# EAGLE design AutonoeGingerBread3 (EAGLE 9.6.2)
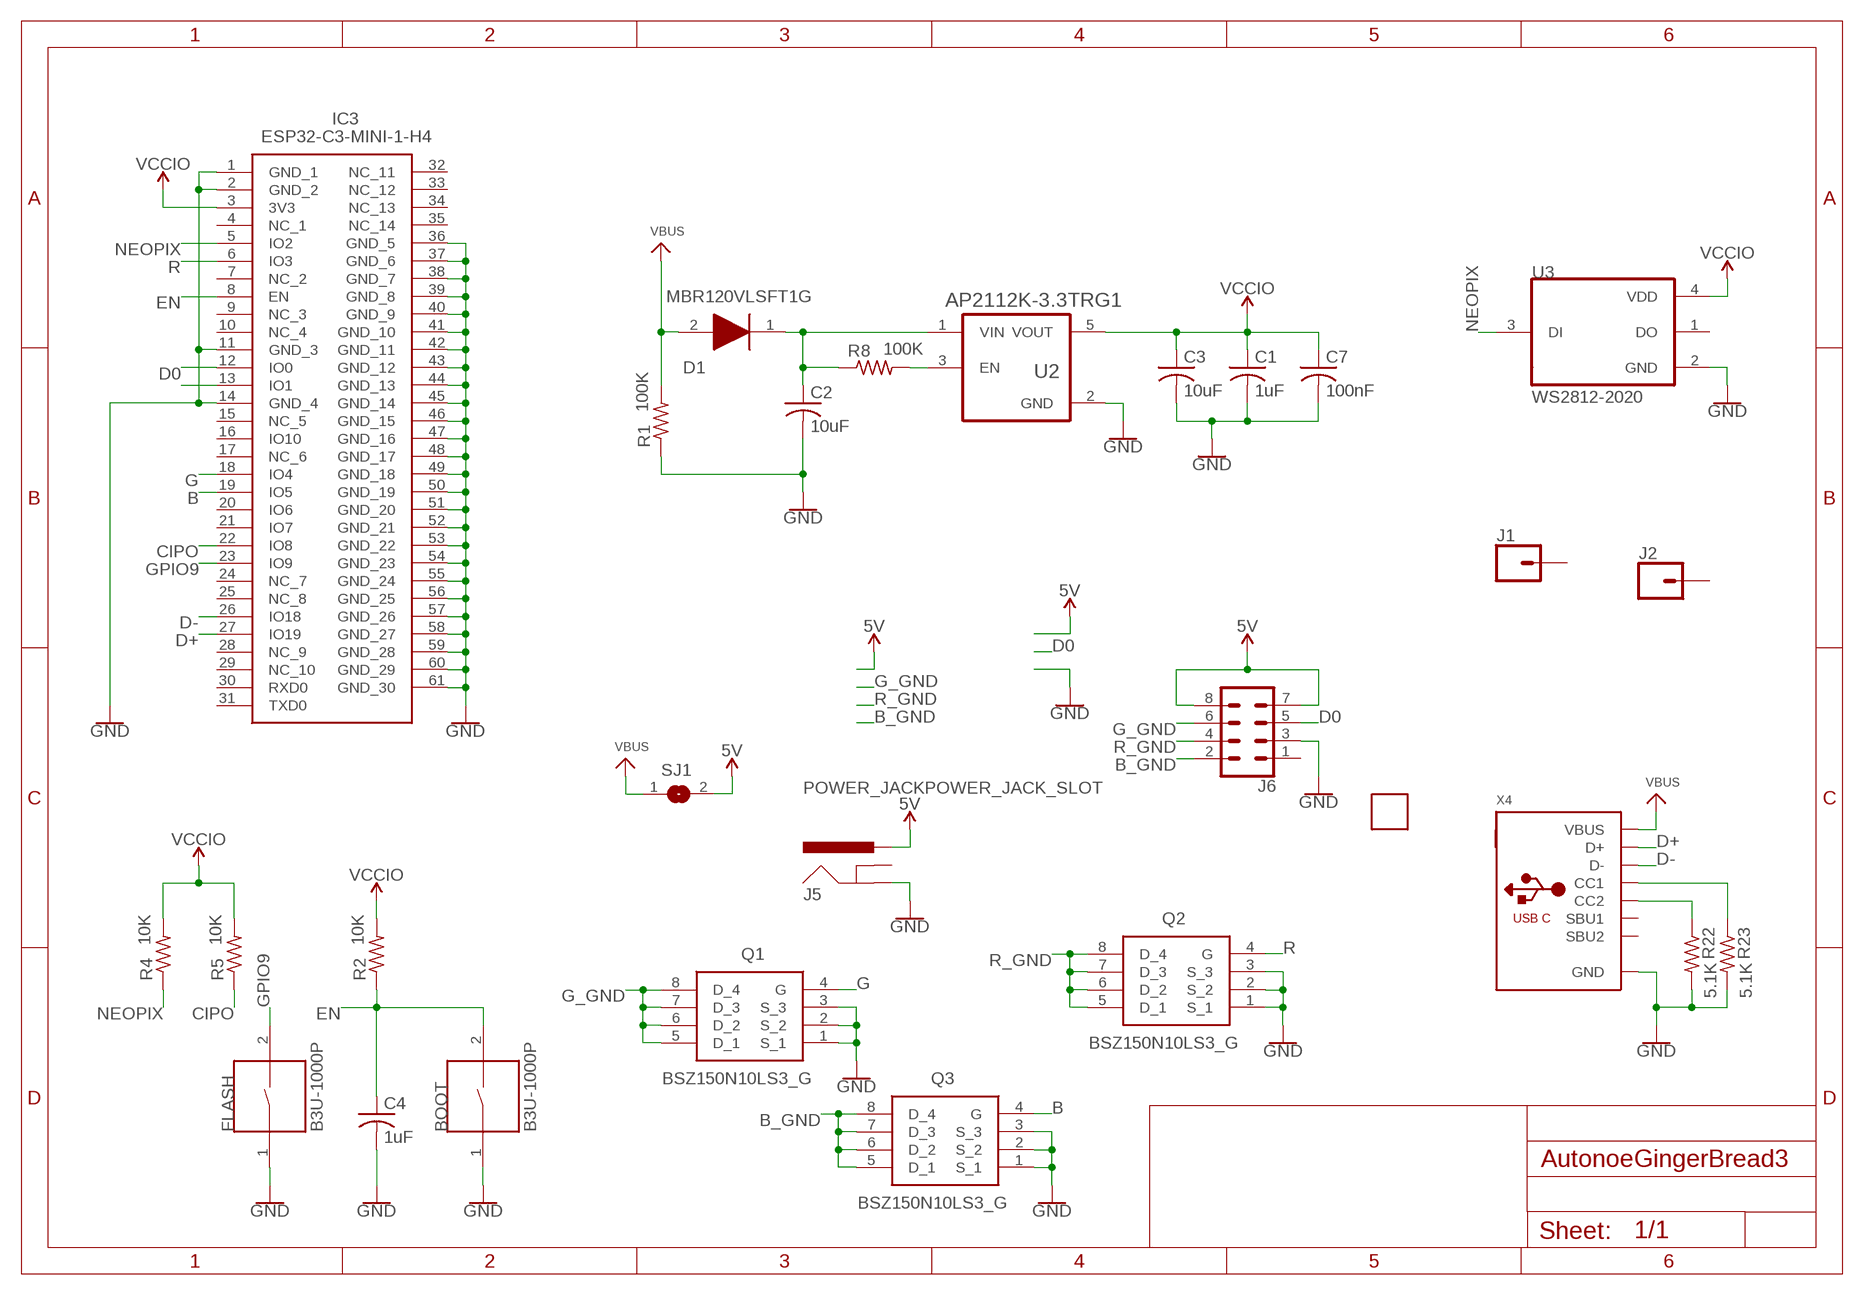
[diagram p0: schematic, sheet 1]

## Parts
BOOT  B3U-1000P  [SW_B3U-1000P]
C1  1uF  C-USC0402  [C0402]
C2  10uF  C-USC0402  [C0402]
C3  10uF  C-USC0402  [C0402]
C4  1uF  C-USC0402  [C0402]
C7  100nF  C-USC0402  [C0402]
D1  MBR120VLSFT1G  [SODFL3616X98N]
FLASH  B3U-1000P  [SW_B3U-1000P]
IC3  ESP32-C3-MINI-1-H4  [ESP32C3MINI1H4]
J1  CONN_01PTH_2MM  [1X01_2MM]
J2  CONN_01PTH_2MM  [1X01_2MM]
J5  POWER_JACKPOWER_JACK_SLOT  [POWER_JACK_PTH_SLOT]
J6  CONN_04X2  [2X4]
Q1  BSZ150N10LS3_G  [BSZ180P03NS3EGATMA1]
Q2  BSZ150N10LS3_G  [BSZ180P03NS3EGATMA1]
Q3  BSZ150N10LS3_G  [BSZ180P03NS3EGATMA1]
R1  100K  R-US_R0402  [R0402]
R2  10K  R-US_R0402  [R0402]
R4  10K  R-US_R0402  [R0402]
R5  10K  R-US_R0402  [R0402]
R8  100K  R-US_R0402  [R0402]
R22  5.1K  R-US_R0402  [R0402]
R23  5.1K  R-US_R0402  [R0402]
SJ1  SJ  [SJ]
U2  AP2112K-3.3TRG1  [SOT95P285X140-5N]
U3  WS2812-2020  [LED_WS2812-2020]
U$3  SMARTT_SMALL  [SMARTT_SMALL]
X4  MICROBUILDER_USB_C  [MICROBUILDER_USB_C_CUSB31-CFM2AX-01-X]

## Nets
5V: J5.PWR J6.7 J6.8 SJ1.2
B: IC3.19(IO5) Q3.4(G)
B_GND: J6.2 Q3.5(D_1) Q3.6(D_2) Q3.7(D_3) Q3.8(D_4)
CIPO: IC3.22(IO8) R5.1
D0: IC3.12(IO0) J6.5
D+: IC3.27(IO19) X4.A6(D+) X4.B6(D+)
D-: IC3.26(IO18) X4.A7(D-) X4.B7(D-)
EN: BOOT.2 C4.1 IC3.8(EN) R2.1
G: IC3.18(IO4) Q1.4(G)
G_GND: J6.6 Q1.5(D_1) Q1.6(D_2) Q1.7(D_3) Q1.8(D_4)
GND: BOOT.1 C1.2 C2.2 C3.2 C4.2 C7.2 FLASH.1 IC3.1(GND_1) IC3.2(GND_2) IC3.11(GND_3) IC3.14(GND_4) IC3.36(GND_5) IC3.37(GND_6) IC3.38(GND_7) IC3.39(GND_8) IC3.40(GND_9) IC3.41(GND_10) IC3.42(GND_11) IC3.43(GND_12) IC3.44(GND_13) IC3.45(GND_14) IC3.46(GND_15) IC3.47(GND_16) IC3.48(GND_17) IC3.49(GND_18) IC3.50(GND_19) IC3.51(GND_20) IC3.52(GND_21) IC3.53(GND_22) IC3.54(GND_23) IC3.55(GND_24) IC3.56(GND_25) IC3.57(GND_26) IC3.58(GND_27) IC3.59(GND_28) IC3.60(GND_29) IC3.61(GND_30) J5.GND J6.3 Q1.1(S_1) Q1.2(S_2) Q1.3(S_3) Q2.1(S_1) Q2.2(S_2) Q2.3(S_3) Q3.1(S_1) Q3.2(S_2) Q3.3(S_3) R1.1 R22.2 R23.2 U2.2(GND) U3.2(GND) X4.A1B12(GND) X4.B1A12(GND)
GPIO9: FLASH.2 IC3.23(IO9)
N$1: IC3.13(IO1)
N$2: C2.1 D1.1(K) R8.1 U2.1(VIN)
N$7: R22.1 X4.B5(CC2)
N$9: R23.1 X4.A5(CC1)
N$23: R8.2 U2.3(EN)
NEOPIX: IC3.5(IO2) R4.1 U3.3(DI)
R: IC3.6(IO3) Q2.4(G)
R_GND: J6.4 Q2.5(D_1) Q2.6(D_2) Q2.7(D_3) Q2.8(D_4)
VBUS: D1.2(A) R1.2 SJ1.1 X4.A4B9(VBUS) X4.B4A9(VBUS)
VCCIO: C1.1 C3.1 C7.1 IC3.3(3V3) R2.2 R4.2 R5.2 U2.5(VOUT) U3.4(VDD)
Unconnected: IC3.4(NC_1) IC3.7(NC_2) IC3.9(NC_3) IC3.10(NC_4) IC3.15(NC_5) IC3.16(IO10) IC3.17(NC_6) IC3.20(IO6) IC3.21(IO7) IC3.24(NC_7) IC3.25(NC_8) IC3.28(NC_9) IC3.29(NC_10) IC3.30(RXD0) IC3.31(TXD0) IC3.32(NC_11) IC3.33(NC_12) IC3.34(NC_13) IC3.35(NC_14) J1.1 J2.1 J5.GNDBREAK J6.1 U3.1(DO) X4.A8(SBU1) X4.B8(SBU2)

## Library data of the parts
BOOT FLASH = B3U-1000P:B3U-1000P: Switch Tactile N.O. SPST Round Button Gull Wing 0.05A 12VDC 1.5N SMD Embossed T/R; AVAILABILITY: Unavailable; DESCRIPTION: Switch Tactile N.O. SPST Round Button Gull Wing 0.05A 12VDC 1.5N SMD Embossed T/R; MF: Omron; MP: B3U-1000P; PACKAGE: None; PRICE: None
C1-C4 C7 = adafruit:C-US: CAPACITOR, American symbol
D1 = MBR120VLSFT1G:MBR120VLSFT1G: Diode Schottky 20V 1A SOD123FL ON Semi MBR120VLSFT1G, SMT Schottky Diode, 20V 1A, 2-Pin SOD-123FL Source: Datasheet <http://www.onsemi.com/pub/Collateral/MBR120VLSFT1-D.PDF>; DESCRIPTION: Diode Schottky 20V 1A SOD123FL ON Semi MBR120VLSFT1G, SMT Schottky Diode, 20V 1A, 2-Pin SOD-123FL; HEIGHT: 0.98mm; MANUFACTURER_NAME: ON Semiconductor; MANUFACTURER_PART_NUMBER: MBR120VLSFT1G; MOUSER_PART_NUMBER: 863-MBR120VLSFT1G; MOUSER_PRICE-STOCK: https://www.mouser.co.uk/ProductDetail/ON-Semiconductor/MBR120VLSFT1G?qs=3JMERSakebpX%252BkItPpFCkg%3D%3D
IC3 = ESP32-C3-MINI-1-H4:ESP32-C3-MINI-1-H4: SMD MODULE, ESP32-C3FH4, PCB ANT Source: Datasheet <https://www.mouser.es/datasheet/2/891/Espressif_ESP32_C3_MINI_1_Datasheet-2006822.pdf>; DESCRIPTION: SMD MODULE, ESP32-C3FH4, PCB ANT; HEIGHT: 2.55mm; MANUFACTURER_NAME: Espressif Systems; MANUFACTURER_PART_NUMBER: ESP32-C3-MINI-1-H4; MOUSER_PART_NUMBER: 356-ESP32-C3-MINI1H4; MOUSER_PRICE-STOCK: https://www.mouser.co.uk/ProductDetail/Espressif-Systems/ESP32-C3-MINI-1-H4?qs=stqOd1AaK78JkwNX13Q9hQ%3D%3D
J1 J2 = SparkFun-Connectors:CONN_01: Single connection point. Often used as Generic Header-pin footprint for 0.1 inch spaced/style header connections On any of the 0.1 inch spaced packages, you can populate with these: Break Away Headers - Straight <https://www.sparkfun.com/products/116> (PRT-00116) Break Away Male Headers - Right Angle <https://www.sparkfun.com/products/553> (PRT-00553) Female Headers <https://www.sparkfun.com/products/115> (PRT-00115) Break Away Headers - Machine Pin <https://www.sparkfun.com/products/117> (PRT-00117) Break Away Female Headers - Swiss Machine Pin <https://www.sparkfun.com/products/743> (PRT-00743) This device is also useful as a general connection point to wire up your design to another part of your project. Our various solder wires solder well into these plated through hole pads. Hook-Up Wire - Assortment (Stranded, 22 AWG) <https://www.sparkfun.com/products/11375> (PRT-11375) Hook-Up Wire - Assortment (Solid Core, 22 AWG) <https://www.sparkfun.com/products/11367> (PRT-11367) View the entire wire category on our website here <https://www.sparkfun.com/categories/141> Special notes: SMTSO-256-ET is a "flush mount" nut for a 4-40 screw. We mostly use this on specialty testbeds; it is a nice way to connect hardware to your PCB at an adjustable hieght. Also note, the SNAP packages are for using a snappable style connector. We sell a baggie of snaps and they are also used on two LilyPad designs: Snap Assortment - 30 pack (male and female) <https://www.sparkfun.com/products/11347> (DEV-11347) LilyPad Arduino SimpleSnap <https://www.sparkfun.com/products/10941> (DEV-10941) LilyPad SimpleSnap Protoboard <https://www.sparkfun.com/products/10940> (DEV-10940)
J5 = SparkFun-Connectors:POWER_JACK: Power Jack Connector This is the standard 5.5mm barrel jack for power. The PTH is the most common, proven, reliable, footprint. The Slot footprint only works if the mill layer is transmitted to the PCB fab house so be warned. Here are the connectors we sell at SparkFun: DC Barrel Power Jack/Connector <https://www.sparkfun.com/products/119> (PRT-00119) DC Barrel Power Jack/Connector (SMD) <https://www.sparkfun.com/products/12748> (PRT-12748) DC Barrel Jack Adapter - Breadboard Compatible <https://www.sparkfun.com/products/10811> (PRT-10811) It is used on this SparkFun product (and many, many others): SparkFun RedBoard - Programmed with Arduino <https://www.sparkfun.com/products/12757> (DEV-12757) Also, if you need a mating power supply or connector, please check these out: Wall Adapter Power Supply - 9VDC 650mA <https://www.sparkfun.com/products/298> (TOL-00298) DC Barrel Jack Adapter - Male <https://www.sparkfun.com/products/10287> (PRT-10287); PROD_ID: CONN-08197
J6 = SparkFun-Connectors:CONN_04X2: Multi connection point. Often used as Generic Header-pin footprint for 0.1 inch spaced/style header connections On any of the 0.1 inch spaced packages, you can populate with these: Break Away Headers - Straight <https://www.sparkfun.com/products/116> (PRT-00116) Break Away Male Headers - Right Angle <https://www.sparkfun.com/products/553> (PRT-00553) Female Headers <https://www.sparkfun.com/products/115> (PRT-00115) Break Away Headers - Machine Pin <https://www.sparkfun.com/products/117> (PRT-00117) Break Away Female Headers - Swiss Machine Pin <https://www.sparkfun.com/products/743> (PRT-00743)
Q1-Q3 = BSZ150N10LS3_G:BSZ150N10LS3_G: MOSFET N-Ch 100V 40A TSDSON-8 Source: Datasheet <https://www.infineon.com/dgdl/Infineon-BSZ150N10LS3_G-DS-v02_02-en.pdf?fileId=db3a30433c8a9179013c8aa12472000f>; DESCRIPTION: MOSFET N-Ch 100V 40A TSDSON-8; HEIGHT: mm; MANUFACTURER_NAME: Infineon; MANUFACTURER_PART_NUMBER: BSZ150N10LS3 G; MOUSER_PART_NUMBER: 726-BSZ150N10LS3G; MOUSER_PRICE-STOCK: https://www.mouser.co.uk/ProductDetail/Infineon-Technologies/BSZ150N10LS3-G?qs=LxJ0xX%2FWJR7cCiHBsoYJ%252Bw%3D%3D
R1 R2 R4 R5 R8 R22 R23 = adafruit:R-US_: RESISTOR, American symbol
SJ1 = jumper:SJ: SMD solder JUMPER
U2 = AP2112K-3.3TRG1:AP2112K-3.3TRG1: AP2112 Series 0.6 A 3.3 V Fixed Output SMT LDO Linear Regulator - SOT23-5; AVAILABILITY: Unavailable; DESCRIPTION: AP2112 Series 0.6 A 3.3 V Fixed Output SMT LDO Linear Regulator - SOT23-5; MF: Diodes Inc.; MP: AP2112K-3.3TRG1; PACKAGE: SOT-753 Diodes Inc.; PRICE: None
U3 = WS2812-2020:WS2812-2020: Intelligent control LED integrated light source Check availability <https://pricing.snapeda.com/parts/WS2812-2020/Worldsemi/view-part?ref=eda>; AVAILABILITY: Not in stock; DESCRIPTION: Intelligent control LED light source, SMD-4; MF: Worldsemi; MP: WS2812-2020; PACKAGE: Package; PRICE: None
U$3 = Bitmaps:SMARTT_SMALL
X4 = Adafruit Feather STM32F405 Express:MICROBUILDER_USB_C: USB Type-C USB 2.0 Connector

## Board
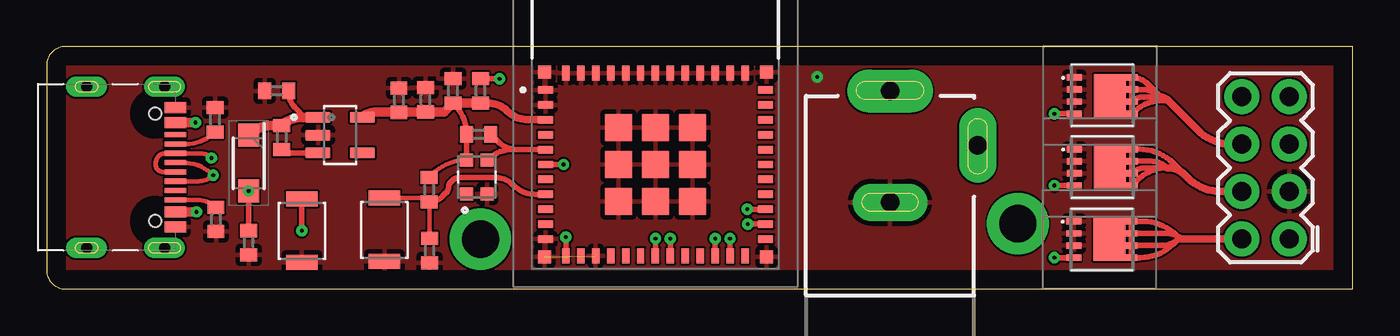
[diagram p1: board, top side]
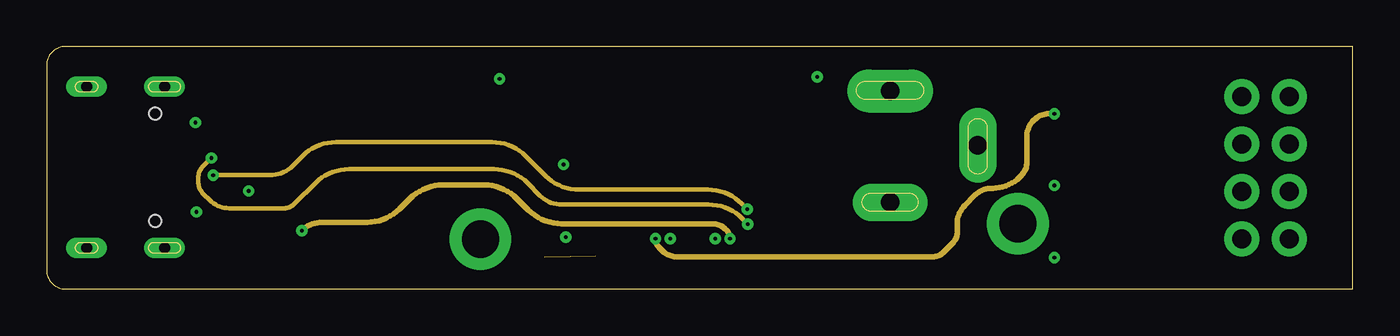
[diagram p2: board, inner layer Route2]
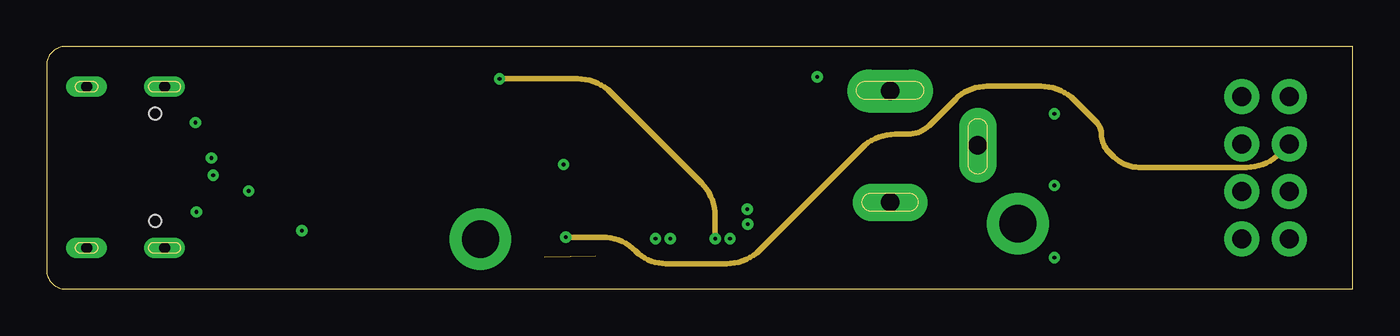
[diagram p3: board, inner layer Route15]
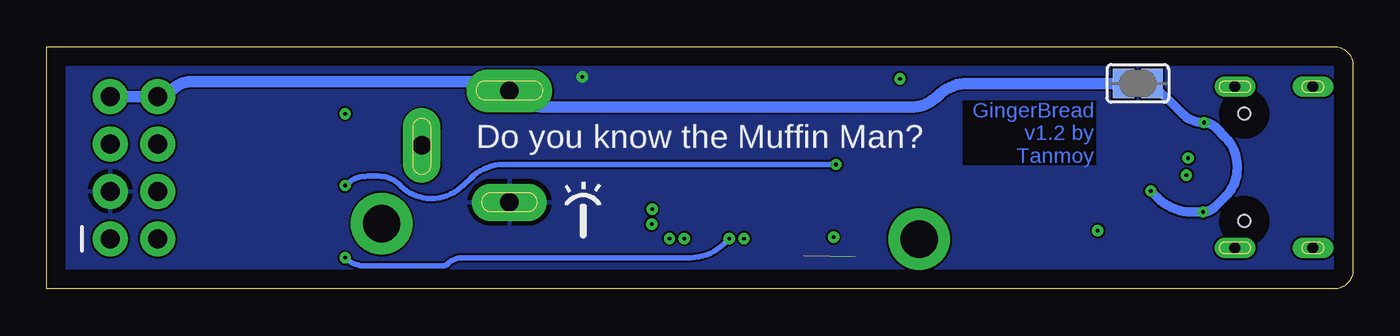
[diagram p4: board, bottom side, seen from below]

Size 70 x 13 mm. Coordinates in mm from the lower left corner, seen from the top.
Outline: 0,12 0,1 arc90 1,0 70,0 70,13 1,13 0.91,13 arc85 0,12
Copper layers (1+2*15+16): Top 0.035mm / dielectric 0.2mm / Route2 0.035mm / dielectric 0.15mm / Route15 0.035mm / dielectric 0.2mm / Bottom 0.035mm
Design rules "default *": minimum track width 4mil, minimum drill 0.2mm, track to track 4mil, track to pad 6mil, pad to pad 4mil, via to via 4mil, smd to smd 4mil, copper to edge 40mil, drill to drill 4mil, minimum pad ring 10mil, minimum via ring 8mil, stop-mask expansion 4mil, vias tented up to drill 0mil, thermal gap 10mil

### Footprints (pad centres in the part's own frame; a part is rotated, then mirrored left to right if it is on the bottom)
SW_B3U-1000P = smd 0.8 x 1.7: 1 -1.7,0; 2 1.7,0
C0402 = smd 0.7 x 0.9: 1 -0.65,0; 2 0.65,0
SODFL3616X98N = smd 1.24 x 1.12: 1 -1.5,0; 2 1.5,0
ESP32C3MINI1H4 = smd 0.8 x 0.4: 1 -5.9,4; 2 -5.9,3.2; 3 -5.9,2.4; 4 -5.9,1.6; 5 -5.9,0.8; 6 -5.9,0; 7 -5.9,-0.8; 8 -5.9,-1.6; 9 -5.9,-2.4; 10 -5.9,-3.2; 11 -5.9,-4; 25 5.9,-4; 26 5.9,-3.2; 27 5.9,-2.4; 28 5.9,-1.6; 29 5.9,-0.8; 30 5.9,0; 31 5.9,0.8; 32 5.9,1.6; 33 5.9,2.4; 34 5.9,3.2; 35 5.9,4 | smd 0.4 x 0.8: 12 -4.8,-4.9; 13 -4,-4.9; 14 -3.2,-4.9; 15 -2.4,-4.9; 16 -1.6,-4.9; 17 -0.8,-4.9; 18 0,-4.9; 19 0.8,-4.9; 20 1.6,-4.9; 21 2.4,-4.9; 22 3.2,-4.9; 23 4,-4.9; 24 4.8,-4.9; 36 4.8,4.9; 37 4,4.9; 38 3.2,4.9; 39 2.4,4.9; 40 1.6,4.9; 41 0.8,4.9; 42 0,4.9; 43 -0.8,4.9; 44 -1.6,4.9; 45 -2.4,4.9; 46 -3.2,4.9; 47 -4,4.9; 48 -4.8,4.9 | smd 1.45 x 1.45: 49 0,0; 50 1.975,1.975; 51 0,1.975; 52 -1.975,1.975; 53 -1.975,0; 54 -1.975,-1.975; 55 0,-1.975; 56 1.975,-1.975; 57 1.975,0 | smd 0.7 x 0.7: 58 -5.95,4.95; 59 -5.95,-4.95; 60 5.95,-4.95; 61 5.95,4.95
1X01_2MM = drill 2 pad 3.302: 1 0,0
POWER_JACK_PTH_SLOT = drill 1 pad 2 long: GND 0,0; GNDBREAK -3.048,4.699 | drill 1 pad 2.3 long: PWR -5.969,0
2X4 = drill 1.016 pad 1.88: 1 -3.81,-1.27; 2 -3.81,1.27; 3 -1.27,-1.27; 4 -1.27,1.27; 5 1.27,-1.27; 6 1.27,1.27; 7 3.81,-1.27; 8 3.81,1.27
BSZ180P03NS3EGATMA1 = smd 0.8 x 0.34: 1 1.5,-0.975; 2 1.5,-0.325; 3 1.5,0.325; 4 1.5,0.975 | smd 0.65 x 0.34: 5 -1.575,0.975; 6 -1.575,0.325; 7 -1.575,-0.325; 8 -1.575,-0.975 | smd 1.71 x 2.29: 9 -0.395,0
R0402 = smd 0.7 x 0.9: 1 -0.65,0; 2 0.65,0
SJ = smd 1.168 x 1.6: 1 -0.762,0; 2 0.762,0
SOT95P285X140-5N = smd 1.35 x 0.6: 1 -1.185,0.95; 2 -1.185,0; 3 -1.185,-0.95; 4 1.185,-0.95; 5 1.185,0.95
LED_WS2812-2020 = smd 0.7 x 0.7: 1 -0.915,0.55; 2 -0.915,-0.55; 3 0.915,-0.55; 4 0.915,0.55
MICROBUILDER_USB_C_CUSB31-CFM2AX-01-X = smd 0.575 x 1.15: A1B12 -3.2,3.545; A4B9 -2.4,3.545; B1A12 3.2,3.545; B4A9 2.4,3.545 | smd 0.275 x 1.15: A5 -1.25,3.545; A6 -0.25,3.545; A7 0.25,3.545; A8 1.25,3.545; B5 1.75,3.545; B6 0.75,3.545; B7 -0.75,3.545; B8 -1.75,3.545 | drill 0.6 pad 1 long: M1 -4.32,2.97; M2 4.32,2.97; M3 -4.32,-1.21; M4 4.32,-1.21 | hole 0.65: 2.89,2.47; -2.89,2.47

### Placement (x,y rotation side)
BOOT  18.1,3.17 90 top
C1  21.77,10.62 90 top
C2  12.32,10.62 180 top
C3  20.3,10.15 90 top
C4  20.52,2.05 270 top
C7  18.88,10.12 90 top
D1  10.82,6.75 270 top
FLASH  13.68,3.12 90 top
IC3  32.62,6.67 0 top
J1  23.25,2.67 0 top
J2  52.05,3.5 0 top
J5  45.2,4.65 270 top
J6  65.33,6.5 90 top
Q1  56.58,10.38 180 top
Q2  56.58,6.53 180 top
Q3  56.55,2.65 180 top
R1  10.82,2.48 90 top
R2  20.5,5.33 90 top
R4  23.15,8.3 180 top
R5  23.25,10.62 270 top
R8  12.6,8.12 270 top
R22  9.07,3.73 270 top
R23  9.03,9.07 90 top
SJ1  11.53,11.03 180 bottom
U2  15.72,8.25 0 top
U3  23.05,6 90 top
U$3  39.98,2.6 0 top
X4  3.35,6.53 270 top

### Tracks (layer width: path | path; a pad name or v marks a point on that pad's centre or on a via)
5V
  Bottom 0.508: 45.08,10.49 J5.PWR | 62.19,11.12 62.26,11.12 | 63.23,10.72 63.28,10.68
  Bottom 0.61: SJ1.2 20.62,11.03 arc-45 22.25,10.35 arc45 23.7,9.75 43.28,9.75 arc45 45.08,10.49 | J5.PWR 45.29,10.71 arc-45 46.3,11.12 62.19,11.12 | 62.26,11.12 arc-45 63.23,10.72 63.35,10.6 arc45 J6.8 J6.7
B  (via drill 0.2)
  Top 0.305: IC3.19 v33.42,2.7 | Q3.4 v54,1.68
  Bottom 0.305: v33.42,2.7 33.71,2.42 arc45 35.5,1.68 47.72,1.68 arc-45 48.5,1.35 arc45 48.8,1.23 52.91,1.23 arc45 v54,1.68
B_GND
  Top 0.305: Q3.7 Q3.8 58.75,3.62 arc-45 60.54,2.88 60.7,2.73 | Q3.6 Q3.7 | Q3.6 Q3.5 58.6,1.68 arc45 60.39,2.42 60.7,2.73 | Q3.7 60.1,2.98 arc-45 60.7,2.73 | Q3.6 59.73,2.33 arc45 60.7,2.73
  Top 0.406: 60.7,2.73 arc45 60.78,2.69 J6.2
CIPO  (via drill 0.2)
  Top 0.305: IC3.22 v35.83,2.7 | R5.1 v24.27,11.28
  Route15 0.305: v24.27,11.28 28.45,11.28 arc-45 30.24,10.53 35.08,5.69 arc-45 35.83,3.9 v35.83,2.7
D0  (via drill 0.2)
  Top 0.305: IC3.12 v27.82,2.77
  Route15 0.305: v27.82,2.77 29.77,2.77 arc-45 31.57,2.03 31.57,2.02 arc45 33.2,1.35 36.42,1.35 arc45 38.22,2.09 43.68,7.56 arc-45 45.48,8.3 46.15,8.3 arc45 47.3,8.78 48.69,10.17 arc-45 50.4,10.88 53.27,10.88 arc-45 55.07,10.13 56.24,8.96 arc-45 56.52,8.28 arc45 56.9,7.38 57.2,7.07 arc45 58.52,6.53 64.3,6.53 arc45 66.09,7.27 J6.5
D+  (via drill 0.2)
  Top 0.254: X4.B6 8.14,5.78 arc45 v8.93,6.1 arc45 7.29,6.78 X4.A6
  Top 0.305: IC3.27 v37.55,4.28
  Route2 0.254: v8.93,6.1 11.97,6.1 arc45 13.18,6.6 13.71,7.13 arc-45 15.5,7.88 23.87,7.88 arc-45 25.67,7.13 26.73,6.07 arc45 28.53,5.33 35.45,5.33 arc-45 37.24,4.58 v37.55,4.28
D-  (via drill 0.2)
  Top 0.254: v8.82,7.03 arc45 8.22,7.28 X4.B7 6.36,7.28 arc45 6,7.12 arc45 5.85,6.76 5.85,6.64 arc45 5.95,6.4 arc45 6.25,6.28 X4.A7
  Top 0.305: IC3.26 v37.58,3.48
  Route2 0.254: v8.82,7.03 8.39,6.59 arc45 8.12,5.95 8.12,5.76 arc45 8.4,5.1 8.75,4.75 arc45 9.78,4.33 12.7,4.33 arc45 13.3,4.58 14.41,5.68 arc-45 16.2,6.42 23.97,6.42 arc-45 25.77,5.68 26.45,5 arc45 27.6,4.53 35.47,4.53 arc-45 37.27,3.78 v37.58,3.48
EN
  Top 0.254: BOOT.2 20.02,4.88 arc-45 R2.1 arc-45 20.52,4.62 C4.1
  Top 0.305: R2.1 arc45 21.23,4.98 21.39,5.14 arc45 21.55,5.53 arc-45 21.62,5.7 21.73,5.8 arc-45 22.15,5.97 24.03,5.97 arc-45 25,5.58 arc45 26.21,5.08 IC3.8
G  (via drill 0.2)
  Top 0.305: IC3.18 v32.62,2.7 | Q1.4 v54,9.4
  Route2 0.305: v32.62,2.7 arc45 32.82,2.23 33.02,2.02 arc45 33.75,1.73 47.47,1.73 arc45 48.07,1.97 48.55,2.45 arc45 48.8,3.05 48.8,3.51 arc-45 49.2,4.47 49.75,5.03 arc-45 50.65,5.4 50.7,5.4 arc45 52.15,6 52.24,6.09 arc45 52.52,6.78 52.52,8.14 arc-45 52.9,9.05 arc-45 53.74,9.4 v54,9.4
G_GND
  Top 0.305: Q1.7 Q1.8 arc-45 59,11 59.57,10.43 arc-45 59.62,10.3 | Q1.6 Q1.7 | Q1.6 Q1.5 arc-45 59.84,10.1 60.1,10.1 | Q1.7 58.66,10.7 arc-45 59.62,10.3 | Q1.6 arc-45 58.75,10.3 59.62,10.3
  Top 0.406: 59.62,10.3 arc-45 60.09,10.11 60.1,10.1 61.69,8.51 arc45 63.48,7.77 J6.6
GND  (via drill 0.2)  (1 unrouted)
  other vias: 41.3,11.38
  pour Top: 69.75,12.75 69.75,0.25 1.25,0.25 arc-90 0.25,1.25 0.25,11.75 arc-90 1.25,12.75
  pour Bottom: 69.75,12.75 69.75,0.25 1.25,0.25 arc-90 0.25,1.25 0.25,11.75 arc-90 1.25,12.75
GPIO9  (via drill 0.2)
  Top 0.305: IC3.23 v36.62,2.7 | FLASH.2 v13.68,3.12
  Route2 0.305: v13.68,3.12 arc-45 14.76,3.58 17.18,3.58 arc45 18.93,4.3 19.46,4.83 arc-45 21.25,5.58 23.42,5.58 arc-45 25.22,4.83 25.81,4.24 arc45 27.6,3.5 35.69,3.5 arc-45 36.35,3.23 36.45,3.13 arc-45 v36.62,2.7
N$2
  Top 0.305: C2.1 arc45 13.28,9.75 13.82,9.2
  Top 0.508: D1.1 arc-45 12.09,8.78 R8.1 arc-45 13.63,9.2 13.82,9.2 U2.1
N$7
  Top 0.254: X4.B5 8.11,4.78 arc-45 R22.1
N$9
  Top 0.254: X4.A5 7.46,7.78 arc45 R23.1
N$23
  Top 0.305: R8.2 arc45 13.02,7.3 U2.3
NEOPIX
  Top 0.305: R4.1 24.18,7.92 arc45 25.25,7.47 | 25.25,7.47 IC3.5 | U3.3 arc-45 24.95,7.47 25.25,7.47
R  (via drill 0.2)
  Top 0.305: IC3.6 v27.7,6.67 | Q2.4 v54,5.55
  Bottom 0.305: v27.7,6.67 45.5,6.67 arc-45 47.29,5.93 47.65,5.58 arc45 49.4,4.85 arc45 51.02,5.52 51.09,5.59 arc-45 52.2,6.05 52.79,6.05 arc-45 v54,5.55
R_GND
  Top 0.305: Q2.7 Q2.8 58.55,7.5 arc-45 60.34,6.76 60.99,6.11 | Q2.7 Q2.6 | Q2.6 Q2.5 58.43,5.83 arc-45 60.05,6.5 | Q2.7 59.2,6.85 arc-45 60.05,6.5 | Q2.6 arc-45 58.87,6.5 60.05,6.5
  Top 0.406: 60.05,6.5 arc-45 60.99,6.11 61.13,5.97 arc45 62.92,5.23 J6.4
VBUS  (via drill 0.2)
  Top 0.305: R1.2 D1.2
  Top 0.508: X4.A4B9 v7.97,8.93 | X4.B4A9 v8.03,4.12
  Bottom 0.508: D1.2 10.44,4.87 arc-45 8.65,4.12 v8.03,4.12 arc-45 7.43,4.37 6.8,5 arc-45 6.2,6.45 6.2,6.62 arc-45 6.83,8.12 7.38,8.68 arc-45 v7.97,8.93 arc45 9.15,9.41 SJ1.1
  other vias: 10.82,5.25
VCCIO
  Top 0.254: U3.4 arc45 20.69,6.17 R2.2
  Top 0.305: C1.1 21.83,9.92 arc-45 R4.2 U3.4
  Top 0.406: IC3.3 25.82,9.07 arc-45 24.68,9.55 arc45 23.65,9.97 R5.2
  Top 0.508: U2.5 U2.5 arc-45 17.57,9.47 C7.1 arc-45 18.93,9.5 C3.1 21.3,9.5 C1.1 R5.2

### Text on the board
Bottom: GingerBread / v1.2 by / Tanmoy
bNames: Do you know the Muffin Man?